# EAGLE board C3D ReMix rev2 (EAGLE 6.4), part 1 of 2
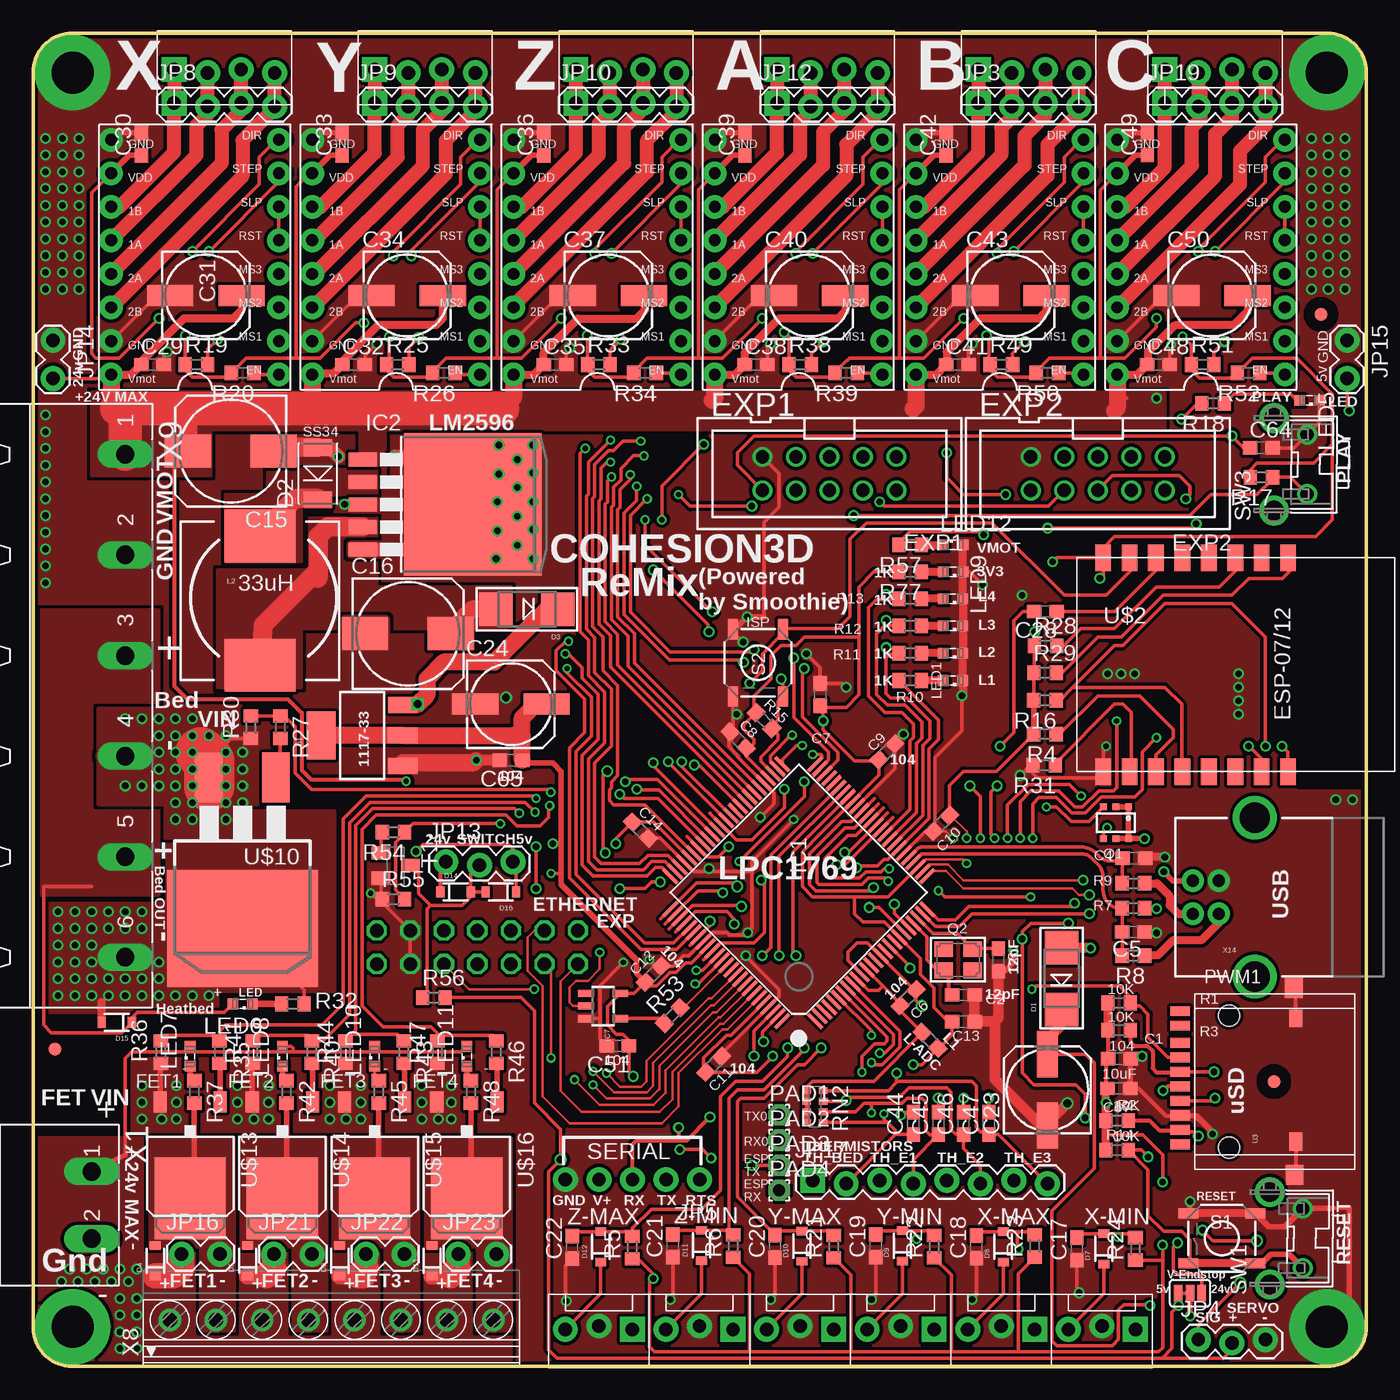
[diagram p3: board, top side]
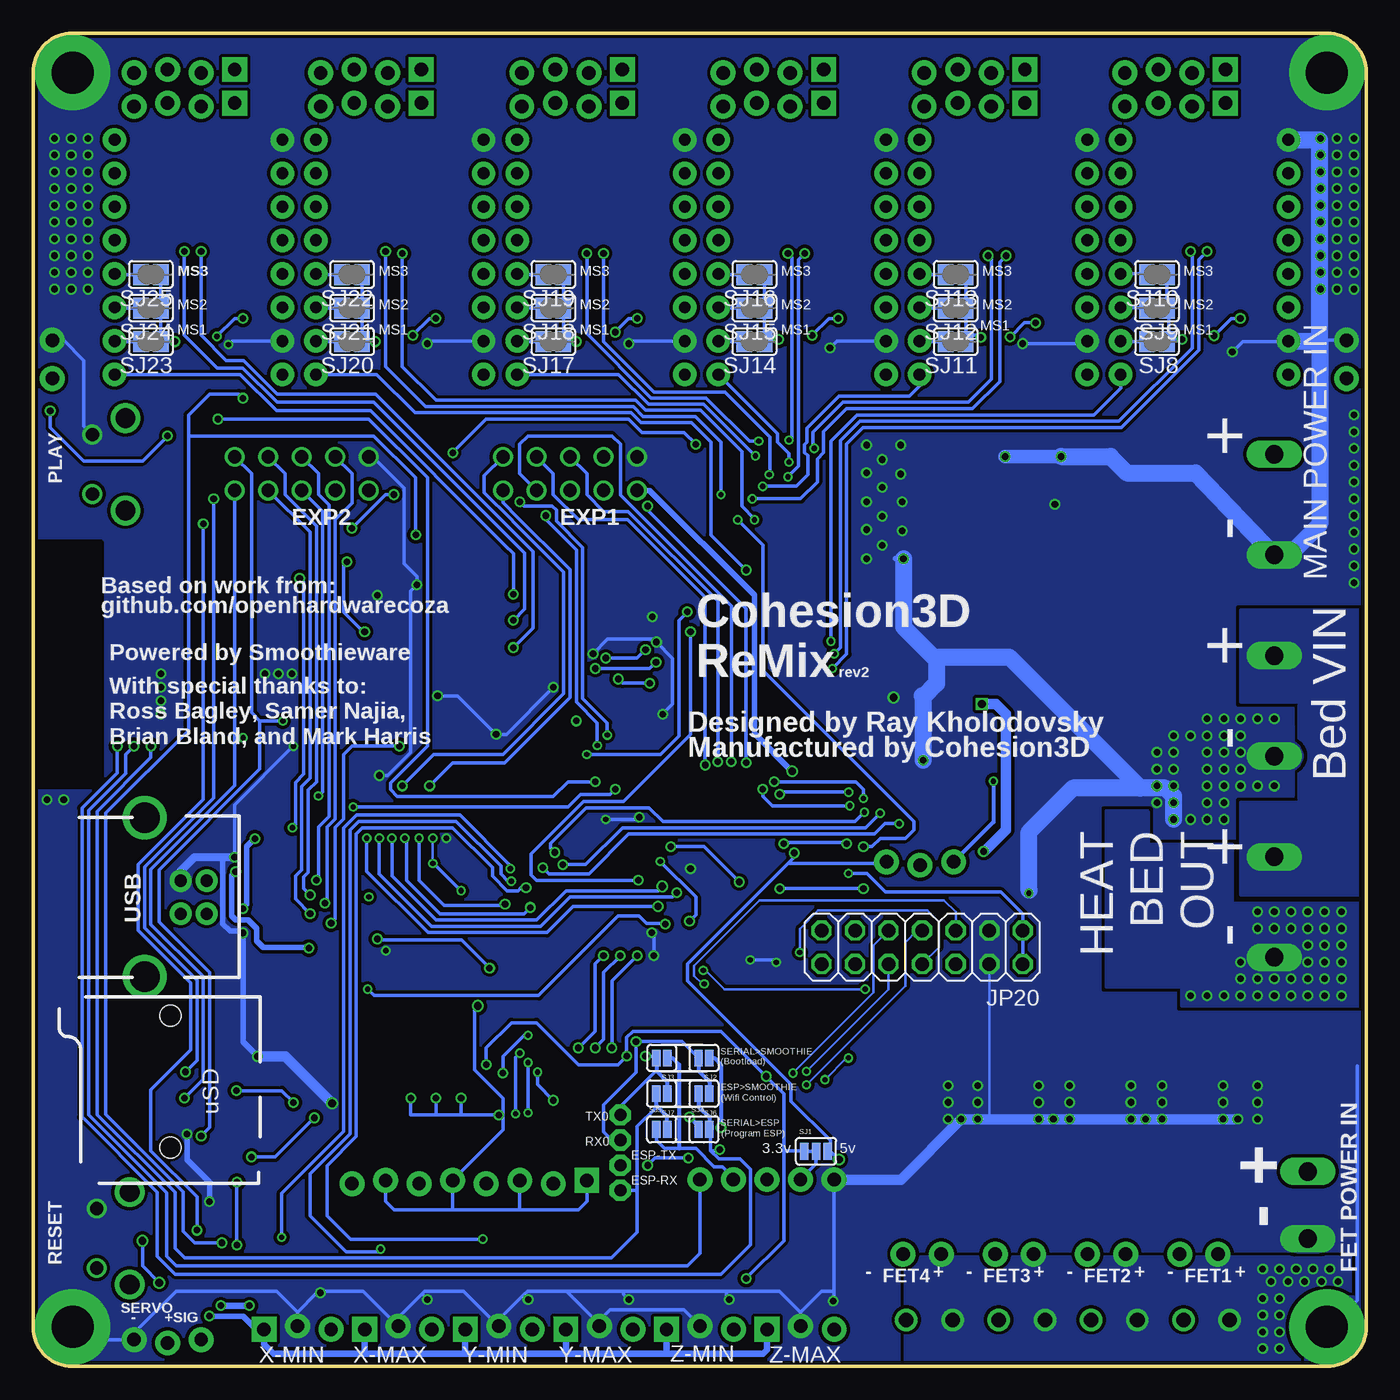
[diagram p4: board, bottom side, seen from below]

Size 101 x 101 mm. Coordinates in mm from the lower left corner, seen from the top.
Outline: 3,0 98,0 arc90 101,3 101,98 arc90 98,101 3,101 arc90 0,98 0,3 arc90 3,0
Copper layers (1*16): Top 0.035mm / dielectric 1.5mm / Bottom 0.035mm
Design rules "dirt_cheap_dirty_boards.v1 *": minimum track width 5mil, minimum drill 12mil, track to track 8mil, track to pad 6mil, pad to pad 6mil, via to via 6mil, smd to smd 0mil, copper to edge 10mil, drill to drill 10mil, minimum pad ring 10mil, minimum via ring 6mil, stop-mask expansion 2mil, vias tented up to drill 25mil, thermal gap 10mil
Net classes: 1 power: width 0.6 mm, clearance 0.305 mm; 2 ground: width 0.254 mm; 4 30-Amp Class: width 2.54 mm; 5 3.3-Amp Class: width 1.27 mm
tRestrict: area 95.9,44 to 101,62.4
bRestrict: area 95.9,44 to 101,62.4

## Footprints (pad centres in the part's own frame; a part is rotated, then mirrored left to right if it is on the bottom)
C0603 = smd 1.1 x 1: 1 -0.85,0; 2 0.85,0
153CLV-0810 = smd 3.5 x 2.5: + 3.25,0; - -3.25,0
153CLV-0605 = smd 3.5 x 1.6: + 2.7,0; - -2.7,0
SMADIODE = smd 2.54 x 2.54: A 2.349,0; C -2.349,0
DO-214AC = smd 1.27 x 2.1: 1 -1.98,0; 2 1.98,0
SOD-323 = smd 0.63 x 0.83: A 1.15,0; C -1.15,0
PAK100/2500-10 = drill 1 pad 1.422: 1 -5.08,-1.27; 2 -5.08,1.27; 3 -2.54,-1.27; 4 -2.54,1.27; 5 0,-1.27; 6 0,1.27; 7 2.54,-1.27; 8 2.54,1.27; 9 5.08,-1.27; 10 5.08,1.27
LQFP100 = smd 0.27 x 1.5: 1 -6,-7.75; 2 -5.5,-7.75; 3 -5,-7.75; 4 -4.5,-7.75; 5 -4,-7.75; 6 -3.5,-7.75; 7 -3,-7.75; 8 -2.5,-7.75; 9 -2,-7.75; 10 -1.5,-7.75; 11 -1,-7.75; 12 -0.5,-7.75; 13 0,-7.75; 14 0.5,-7.75; 15 1,-7.75; 16 1.5,-7.75; 17 2,-7.75; 18 2.5,-7.75; 19 3,-7.75; 20 3.5,-7.75; 21 4,-7.75; 22 4.5,-7.75; 23 5,-7.75; 24 5.5,-7.75; 25 6,-7.75; 51 6,7.75; 52 5.5,7.75; 53 5,7.75; 54 4.5,7.75; 55 4,7.75; 56 3.5,7.75; 57 3,7.75; 58 2.5,7.75; 59 2,7.75; 60 1.5,7.75; 61 1,7.75; 62 0.5,7.75; 63 0,7.75; 64 -0.5,7.75; 65 -1,7.75; 66 -1.5,7.75; 67 -2,7.75; 68 -2.5,7.75; 69 -3,7.75; 70 -3.5,7.75; 71 -4,7.75; 72 -4.5,7.75; 73 -5,7.75; 74 -5.5,7.75; 75 -6,7.75 | smd 1.5 x 0.27: 26 7.75,-6; 27 7.75,-5.5; 28 7.75,-5; 29 7.75,-4.5; 30 7.75,-4; 31 7.75,-3.5; 32 7.75,-3; 33 7.75,-2.5; 34 7.75,-2; 35 7.75,-1.5; 36 7.75,-1; 37 7.75,-0.5; 38 7.75,0; 39 7.75,0.5; 40 7.75,1; 41 7.75,1.5; 42 7.75,2; 43 7.75,2.5; 44 7.75,3; 45 7.75,3.5; 46 7.75,4; 47 7.75,4.5; 48 7.75,5; 49 7.75,5.5; 50 7.75,6; 76 -7.75,6; 77 -7.75,5.5; 78 -7.75,5; 79 -7.75,4.5; 80 -7.75,4; 81 -7.75,3.5; 82 -7.75,3; 83 -7.75,2.5; 84 -7.75,2; 85 -7.75,1.5; 86 -7.75,1; 87 -7.75,0.5; 88 -7.75,0; 89 -7.75,-0.5; 90 -7.75,-1; 91 -7.75,-1.5; 92 -7.75,-2; 93 -7.75,-2.5; 94 -7.75,-3; 95 -7.75,-3.5; 96 -7.75,-4; 97 -7.75,-4.5; 98 -7.75,-5; 99 -7.75,-5.5; 100 -7.75,-6
TO263-5 = smd 1.067 x 2.159: 1 -3.404,-5.791; 2 -1.702,-5.791; 3 0,-5.791; 4 1.702,-5.791; 5 3.404,-5.791 | smd 10.8 x 10.41: 6 0,2.54
SOT23-5 = smd 0.55 x 1.2: 1 -0.95,-1.3; 2 0,-1.3; 3 0.95,-1.3; 4 0.95,1.3; 5 -0.95,1.3
MOLEX-1X4_LOCK = drill 1.016 pad 1.88 square: 1 0,0.127 | drill 1.016 pad 1.88: 2 2.54,-0.127; 3 5.08,0.127; 4 7.62,-0.127
1X04_LOCK = drill 1.016 pad 1.88 square: 1 0,0.127 | drill 1.016 pad 1.88: 2 2.54,-0.127; 3 5.08,0.127; 4 7.62,-0.127
1X03_LOCK = drill 1.016 pad 1.88: 1 0,0.127; 2 2.54,-0.127; 3 5.08,0.127
1X05_NO_SILK = drill 1.016 pad 1.88: 1 0,0; 2 2.54,0; 3 5.08,0; 4 7.62,0; 5 10.16,0
1X02_LOCK = drill 1.016 pad 1.88: 1 -0.178,0; 2 2.718,0
1X08_LOCK = drill 1.016 pad 1.88 square: 1 0,0.127 | drill 1.016 pad 1.88: 2 2.54,-0.127; 3 5.08,0.127; 4 7.62,-0.127; 5 10.16,0.127; 6 12.7,-0.127; 7 15.24,0.127; 8 17.78,-0.127
2X07 = drill 1.016 octagon: 1 -7.62,-1.27; 2 -7.62,1.27; 3 -5.08,-1.27; 4 -5.08,1.27; 5 -2.54,-1.27; 6 -2.54,1.27; 7 0,-1.27; 8 0,1.27; 9 2.54,-1.27; 10 2.54,1.27; 11 5.08,-1.27; 12 5.08,1.27; 13 7.62,-1.27; 14 7.62,1.27
0603 = smd 1.1 x 1: 1 -0.85,0; 2 0.85,0
CDRH125 = smd 5.4 x 4: 1 0,4.9; 2 0,-4.9
SML0603 = smd 0.8 x 0.8: A 0.75,0; C -0.75,0
1,6/0,9 = drill 0.914 pad 1.6 octagon: 1 0,0
SC74_INFINEON = smd 0.5 x 0.5: 1 -0.95,-1.2; 2 0,-1.2; 3 0.95,-1.2; 4 0.95,1.2; 5 0,1.2; 6 -0.95,1.2
CRYSTAL_3.2X2.5 = smd 1.4 x 1.2: 1 -1.1,-0.8; 2 1.1,0.8; GND1 -1.1,0.8; GND2 1.1,-0.8
R0603 = smd 1 x 1.1: 1 -0.85,0; 2 0.85,0
0603-ARV = smd 0.5 x 0.65: 1 -1.2,-0.625; 2 -0.4,-0.625; 3 0.4,-0.625; 4 1.2,-0.625; 5 1.2,0.625; 6 0.4,0.625; 7 -0.4,0.625; 8 -1.2,0.625
TACTILE_SWITCH_SMD = smd 1.524 x 0.762: 1 -2.54,1.905; 2 2.54,1.905; 3 -2.54,-1.905; 4 2.54,-1.905
SJ_3 = smd 0.635 x 1.27: 1 -0.889,0; 2 0,0; 3 0.889,0
SJ_2S = smd 0.635 x 1.27: 1 -0.412,0; 2 0.412,0
SJ = smd 1.168 x 1.6: 1 -0.762,0; 2 0.762,0
SW_TACT_STANDARD_RIGHT_ANGLE = drill 1: 1 -2.25,0; 2 2.25,0 | drill 1.5: 3 -3.5,2.5; 4 3.5,2.5
SOT23-BEC = smd 1 x 1.4: B -0.95,-1.1; C 0,1.1; E 0.95,-1.1
SOT223 = smd 1.219 x 2.235: 1 -2.311,-3.099; 2 0,-3.099; 3 2.311,-3.099 | smd 3.6 x 2.2: 4 0,3.099
USD-SOCKET-PP = smd 0.75 x 1.5: 1 2.925,1.125; 2 1.825,1.125; 3 0.725,1.125; 4 -0.375,1.125; 5 -1.475,1.125; 6 -2.575,1.125; 7 -3.675,1.125; 8 -4.775,1.125; CD1 5.325,1.125; CD2 4.225,1.125 | smd 1.4 x 1: CDNC1 -4.55,-7.65 | smd 1.3 x 1: CDNC2 4.775,-7.65 | smd 1.5 x 1.35: GND1 -7.075,-7.55; GND2 7.075,-7.5 | hole 1.6: -5,-2.6; 5,-2.6
A4988BREAKOUT = drill 0.9 pad 1.778: 1A 8.89,1.27; 1B 11.43,1.27; 2A 6.35,1.27; 2B 3.81,1.27; DIR 16.51,-11.43; EN -1.27,-11.43; GND 16.51,1.27; GND@0 1.27,1.27; MS1 1.27,-11.43; MS2 3.81,-11.43; MS3 6.35,-11.43; RST 8.89,-11.43; SLP 11.43,-11.43; STEP 13.97,-11.43; VDD 13.97,1.27; VMOT -1.27,1.27
ESP8266-ESP12 = smd 2 x 1.2: 1 16.2,2; 2 16.2,4; 3 16.2,6; 4 16.2,8; 5 16.2,10; 6 16.2,12; 7 16.2,14; 8 16.2,16; 9 0,16; 10 0,14; 11 0,12; 12 0,10; 13 0,8; 14 0,6; 15 0,4; 16 0,2
D2PACK = smd 2.083 x 3.81: 1 -2.54,-8.89; 3 2.54,-8.89 | smd 11.43 x 8.89: 2 0,2.54
FIDUCIAL_1MM = smd 1 x 1: 1 0,0
D-PAK_TO252AA = smd 1 x 1.6: 1 -2.28,-4.8; 3 2.28,-4.8 | smd 5.4 x 6.2: 4 0,2.5
MSTBA2 = drill 1.397 long: 1 -2.54,5.08; 2 2.54,5.08
1751303 = drill 1.1 pad 1.7: 1 -12.25,-0.1; 2 -8.75,-0.1; 3 -5.25,-0.1; 4 -1.75,-0.1; 5 1.75,-0.1; 6 5.25,-0.1; 7 8.75,-0.1; 8 12.25,-0.1
GMSTBA6 = drill 1.397 long: 1 -19.05,5.08; 2 -11.43,5.08; 3 -3.81,5.08; 4 3.81,5.08; 5 11.43,5.08; 6 19.05,5.08
USB-B-PTH = drill 0.914 pad 1.676: D+ 0,1.25; D- 1.981,1.25; GND 0,-1.25; VBUS 1.981,-1.25 | drill 2.286: S1 -2.718,-6.02; S2 -2.718,6.02
MOLEX-1X3_LOCK = drill 1.016 pad 1.88 square: 1 0,0.127 | drill 1.016 pad 1.88: 2 2.54,-0.127; 3 5.08,0.127

## Placement (x,y rotation side)
C1  104  [C0603]  82.29,23.32 180 top
C2  12pF  [C0603]  70.47,28.14 0 top
C3  12pF  [C0603]  73.11,30.81 270 top
C4  18pF  [C0603]  83.39,38.5 180 top
C5  18pF  [C0603]  83.34,32.91 180 top
C6  104  [C0603]  66.28,27.93 45 top
C7  10uF  [C0603]  59.62,50.88 90 top
C8  104  [C0603]  53.41,47.46 315 top
C9  104  [C0603]  64.67,46.56 225 top
C10  104  [C0603]  68.81,41.14 45 top
C11  104  [C0603]  51.55,22.88 225 top
C12  104  [C0603]  46.98,29.72 225 top
C13  104  [C0603]  70.46,26.12 180 top
C14  104  [C0603]  46.01,40.63 135 top
C15  220uF  [153CLV-0810]  14.99,69.34 180 top
C16  220uF  [153CLV-0810]  28.4,55.5 0 top
C17  104  [C0603]  79.07,8.93 90 top
C18  104  [C0603]  71.45,9.06 90 top
C19  104  [C0603]  63.83,9.14 90 top
C20  104  [C0603]  56.21,9.12 90 top
C21  104  [C0603]  48.46,9.14 90 top
C22  104  [C0603]  40.84,9.01 90 top
C23  100uF  [153CLV-0605]  76.83,20.95 90 top
C24  100uF  [153CLV-0605]  36.2,50.16 0 top
C28  104  [C0603]  76.69,57.19 180 top
C29  104  [C0603]  9.05,75.88 0 top
C30  104  [C0603]  8.21,92.58 90 top
C31  100uF  [153CLV-0605]  13.1,81.12 0 top
C32  104  [C0603]  24.29,75.88 0 top
C33  104  [C0603]  23.42,92.58 90 top
C34  100uF  [153CLV-0605]  28.34,81.12 0 top
C35  104  [C0603]  39.53,75.88 0 top
C36  104  [C0603]  38.69,92.58 90 top
C37  100uF  [153CLV-0605]  43.58,81.12 0 top
C38  104  [C0603]  54.77,75.88 0 top
C39  104  [C0603]  53.93,92.58 90 top
C40  100uF  [153CLV-0605]  58.82,81.12 0 top
C41  104  [C0603]  70.01,75.88 0 top
C42  104  [C0603]  69.17,92.58 90 top
C43  100uF  [153CLV-0605]  74.06,81.12 0 top
C44  10uF  [C0603]  66.67,18.41 90 top
C45  10uF  [C0603]  68.58,18.41 90 top
C46  10uF  [C0603]  70.48,18.41 90 top
C47  10uF  [C0603]  72.39,18.41 90 top
C48  104  [C0603]  85.25,75.88 0 top
C49  104  [C0603]  84.41,92.6 90 top
C50  100uF  [153CLV-0605]  89.3,81.12 0 top
C51  104  [C0603]  44.29,24.29 180 top
C64  10uF  [C0603]  93.03,69.57 0 top
C65  104  [C0603]  36.21,45.92 180 top
C67  10uF  [C0603]  82.25,21.07 180 top
D1  MBRA210LT3  [SMADIODE]  77.9,29.39 90 top
D2  SS34  [DO-214AC]  21.59,67.63 90 top
D3  MBRA210LT3  [SMADIODE]  37.41,57.36 180 top
D4  1N4148  [SOD-323]  9.27,8 90 top
D5  1N4148  [SOD-323]  16.26,8 90 top
D6  1N4148  [SOD-323]  23.24,8 90 top
D7  1N4148  [SOD-323]  81.1,8.91 90 top
D8  1N4148  [SOD-323]  73.48,9.06 90 top
D9  1N4148  [SOD-323]  65.86,9.14 90 top
D10  1N4148  [SOD-323]  58.24,9.12 90 top
D11  1N4148  [SOD-323]  50.62,9.17 90 top
D12  1N4148  [SOD-323]  43,9.06 90 top
D13  1N4148  [SOD-323]  30.23,8 90 top
D14  1N4148  [SOD-323]  32,35.94 0 top
D15  1N4148  [SOD-323]  6.35,26.07 180 top
D16  1N4148  [SOD-323]  35.43,35.94 180 top
EXP1  2510-  [PAK100/2500-10]  60.33,67.63 180 top
EXP2  2510-  [PAK100/2500-10]  80.64,67.63 180 top
IC1  LPC1769  [LQFP100]  58,35.89 45 top
IC2  LM2596-5  [TO263-5]  30.77,65.29 270 top
IC7  74LVC1G04  [SOT23-5]  43.18,27.3 270 top
JP1  [MOLEX-1X4_LOCK]  71.6,98.11 0 top
JP2  [MOLEX-1X4_LOCK]  25.88,98.11 0 top
JP3  [1X04_LOCK]  71.6,95.57 0 top
JP4  [1X03_LOCK]  88.27,1.91 0 top
JP5  [1X05_NO_SILK]  50.49,14.15 180 top
JP6  [MOLEX-1X4_LOCK]  10.68,98.11 0 top
JP7  [MOLEX-1X4_LOCK]  41.12,98.11 0 top
JP8  [1X04_LOCK]  10.68,95.57 0 top
JP9  [1X04_LOCK]  25.88,95.57 0 top
JP10  [1X04_LOCK]  41.12,95.57 0 top
JP11  [MOLEX-1X4_LOCK]  56.36,98.11 0 top
JP12  [1X04_LOCK]  56.36,95.57 0 top
JP13  [1X03_LOCK]  31.27,38.1 0 top
JP14  [1X02_LOCK]  1.51,77.55 270 top
JP15  [1X02_LOCK]  99.54,77.55 270 top
JP16  [1X02_LOCK]  11.43,8.51 0 top
JP17  [1X08_LOCK]  59.05,13.97 0 top
JP18  [MOLEX-1X4_LOCK]  85.72,98.11 0 top
JP19  [1X04_LOCK]  85.72,95.57 0 top
JP20  [2X07]  33.66,31.75 180 bottom
JP21  [1X02_LOCK]  18.41,8.51 0 top
JP22  [1X02_LOCK]  25.4,8.51 0 top
JP23  [1X02_LOCK]  32.38,8.51 0 top
L1  39nH  [0603]  67.94,24.7 315 top
L2  33uH  [CDRH125]  17.2,58.01 0 top
LED1  GREEN  [SML0603]  69.68,51.96 180 top
LED2  GREEN  [SML0603]  69.68,54.04 180 top
LED3  GREEN  [SML0603]  69.68,56.1 180 top
LED4  GREEN  [SML0603]  69.68,58.15 180 top
LED5  GREEN  [SML0603]  96.68,73.18 180 top
LED6  RED  [SML0603]  15.88,27.46 180 top
LED7  RED  [SML0603]  11.91,23.5 90 top
LED8  RED  [SML0603]  18.89,23.5 90 top
LED9  GREEN  [SML0603]  69.69,60.19 180 top
LED10  RED  [SML0603]  25.88,23.5 90 top
LED11  RED  [SML0603]  32.86,23.5 90 top
LED12  RED  [SML0603]  69.69,62.23 0 top
PAD1  [1,6/0,9]  56.52,19.05 0 top
PAD2  [1,6/0,9]  56.52,17.14 0 top
PAD3  [1,6/0,9]  56.52,15.24 0 top
PAD4  [1,6/0,9]  56.52,13.34 0 top
Q1  BSL207SP  [SC74_INFINEON]  82.02,41.18 180 top
Q2  12MHz  [CRYSTAL_3.2X2.5]  70.06,30.81 180 top
R1  10K  [R0603]  82.27,27.54 180 top
R2  10K  [R0603]  82.11,18.64 180 top
R3  10K  [R0603]  82.27,25.46 180 top
R4  10K  [R0603]  76.64,47.9 180 top
R5  10K  [R0603]  45.39,9.02 90 top
R6  10K  [R0603]  53.03,9.13 90 top
R7  1.5k  [R0603]  83.34,34.7 0 top
R8  33R  [R0603]  83.34,31.13 180 top
R9  33R  [R0603]  83.34,36.59 180 top
R10  1k  [R0603]  66.44,51.96 180 top
R11  1k  [R0603]  66.44,54.04 180 top
R12  1k  [R0603]  66.44,56.1 180 top
R13  1k  [R0603]  66.44,58.15 180 top
R14  10K  [R0603]  82.11,16.39 180 top
R15  10K  [R0603]  55.37,48.92 135 top
R16  10K  [R0603]  76.64,50.45 180 top
R17  10K  [R0603]  93.04,67.36 180 top
R18  1k  [R0603]  89.38,72.95 180 top
R19  1k  [R0603]  12.38,75.88 0 top
R20  10K  [R0603]  15.88,75.25 180 top
R21  10K  [R0603]  60.65,9.08 90 top
R22  10K  [R0603]  68.25,9.08 90 top
R23  10K  [R0603]  75.87,9.13 90 top
R24  10K  [R0603]  83.49,8.91 90 top
R25  1k  [R0603]  27.62,75.88 0 top
R26  10k  [R0603]  31.11,75.25 180 top
R27  10r  [R0603]  18.73,48.42 270 top
R28  10K  [R0603]  76.69,54.6 0 top
R29  10K  [R0603]  76.65,52.53 0 top
R30  100k  [R0603]  16.51,48.42 90 top
R31  10K  [R0603]  76.59,45.55 180 top
R32  1.5k  [R0603]  19.68,27.46 0 top
R33  1k  [R0603]  42.86,75.88 0 top
R34  10K  [R0603]  46.35,75.25 180 top
R35  10r  [R0603]  14.13,23.81 270 top
R36  100k  [R0603]  9.68,23.81 90 top
R37  1.5k  [R0603]  12.22,20.8 270 top
R38  1k  [R0603]  58.1,75.88 0 top
R39  10K  [R0603]  61.59,75.25 180 top
R40  10r  [R0603]  21.11,23.81 270 top
R41  100k  [R0603]  16.67,23.81 90 top
R42  1.5k  [R0603]  19.21,20.8 270 top
R43  10r  [R0603]  28.1,23.81 270 top
R44  100k  [R0603]  23.65,23.81 90 top
R45  1.5k  [R0603]  26.19,20.8 270 top
R46  10r  [R0603]  35.08,23.81 270 top
R47  100k  [R0603]  30.64,23.81 90 top
R48  1.5k  [R0603]  33.18,20.8 270 top
R49  1k  [R0603]  73.34,75.88 0 top
R50  10K  [R0603]  76.83,75.25 180 top
R51  1k  [R0603]  88.58,75.88 0 top
R52  10K  [R0603]  92.08,75.25 180 top
R53  22R  [R0603]  48.42,26.59 45 top
R54  10r  [R0603]  27.3,40.48 180 top
R55  100k  [R0603]  27.3,35.4 0 top
R56  10k  [R0603]  30.35,27.94 0 top
R57  1.5k  [R0603]  66.44,62.23 180 top
R77  1k  [R0603]  66.44,60.19 180 top
RN2  4k7  [0603-ARV]  59.21,19.68 90 top
S1  [TACTILE_SWITCH_SMD]  90.04,9.71 180 top
S2  [TACTILE_SWITCH_SMD]  54.91,53.3 270 top
SJ1  [SJ_3]  41.69,16.31 0 bottom
SJ2  [SJ_2S]  50.18,23.36 180 bottom
SJ3  [SJ_2S]  53.38,23.36 180 bottom
SJ4  [SJ_2S]  50.18,17.96 0 bottom
SJ5  [SJ_2S]  53.38,17.96 0 bottom
SJ6  [SJ_2S]  50.18,20.66 180 bottom
SJ7  [SJ_2S]  53.38,20.66 180 bottom
SJ8  [SJ]  15.88,77.63 180 bottom
SJ9  [SJ]  15.88,80.17 180 bottom
SJ10  [SJ]  15.88,82.71 180 bottom
SJ11  [SJ]  31.11,77.63 180 bottom
SJ12  [SJ]  31.11,80.17 180 bottom
SJ13  [SJ]  31.11,82.71 180 bottom
SJ14  [SJ]  46.35,77.63 180 bottom
SJ15  [SJ]  46.35,80.17 180 bottom
SJ16  [SJ]  46.35,82.71 180 bottom
SJ17  [SJ]  61.59,77.63 180 bottom
SJ18  [SJ]  61.59,80.17 180 bottom
SJ19  [SJ]  61.59,82.71 180 bottom
SJ20  [SJ]  76.83,77.63 180 bottom
SJ21  [SJ]  76.83,80.17 180 bottom
SJ22  [SJ]  76.83,82.71 180 bottom
SJ23  [SJ]  92.08,77.63 180 bottom
SJ24  [SJ]  92.08,80.17 180 bottom
SJ25  [SJ]  92.08,82.71 180 bottom
SJ26  [SJ_3]  87.63,5.56 0 top
SW1  SW_TACT_4P_B  [SW_TACT_STANDARD_RIGHT_ANGLE]  96.18,9.71 90 top
SW3  SW_TACT_4P_B  [SW_TACT_STANDARD_RIGHT_ANGLE]  96.5,68.33 90 top
T1  BC817  [SOT23-BEC]  27.46,37.94 270 top
U1  1117-3.3  [SOT223]  24.92,47.79 90 top
U3  USD-SOCKETUSD  [USD-SOCKET-PP]  88,21.59 90 top
U$1  POLOLU_A4983CARRIER  [A4988BREAKOUT]  7.19,76.41 90 top
U$2  ESP8266_ESP-12  [ESP8266-ESP12]  79.06,61.26 270 top
U$5  POLOLU_A4983CARRIER  [A4988BREAKOUT]  22.42,76.41 90 top
U$6  POLOLU_A4983CARRIER  [A4988BREAKOUT]  37.66,76.41 90 top
U$7  POLOLU_A4983CARRIER  [A4988BREAKOUT]  52.9,76.41 90 top
U$8  POLOLU_A4983CARRIER  [A4988BREAKOUT]  68.14,76.41 90 top
U$9  POLOLU_A4983CARRIER  [A4988BREAKOUT]  83.38,76.41 90 top
U$10  SUM120N04-1M7L-GE3  [D2PACK]  15.88,35.72 180 top
U$11  FIDUCIAL  [FIDUCIAL_1MM]  93.98,21.59 0 top
U$12  FIDUCIAL  [FIDUCIAL_1MM]  97.55,79.69 0 top
U$13  SUD50N04  [D-PAK_TO252AA]  11.91,15.24 180 top
U$14  SUD50N04  [D-PAK_TO252AA]  18.89,15.24 180 top
U$15  SUD50N04  [D-PAK_TO252AA]  25.88,15.24 180 top
U$16  SUD50N04  [D-PAK_TO252AA]  32.86,15.24 180 top
U$17  FIDUCIAL  [FIDUCIAL_1MM]  1.65,24.03 0 top
X1  MSTBA2  [MSTBA2]  -0.64,12.22 270 top
X8  1751303  [1751303]  22.61,3.63 0 top
X9  GMSTBA6  [GMSTBA6]  1.91,50.04 270 top
X14  USBPTH  [USB-B-PTH]  89.82,35.54 180 top
XMN  [MOLEX-1X3_LOCK]  83.5,2.94 180 top
XMX  [MOLEX-1X3_LOCK]  75.88,2.94 180 top
YMN  [MOLEX-1X3_LOCK]  68.26,2.94 180 top
YMX  [MOLEX-1X3_LOCK]  60.64,2.94 180 top
ZMN  [MOLEX-1X3_LOCK]  53.02,2.94 180 top
ZMX  [MOLEX-1X3_LOCK]  45.4,2.94 180 top

## Tracks (layer width: path | path; a pad name or v marks a point on that pad's centre or on a via)
1A1M
  Top 1.016: JP8.2 13.22,94.82
  Top 1.067: 13.22,94.82 12.38,93.98 12.38,91.76 U$1.1A | JP8.2 JP6.2
1A2M
  Top 1.067: JP2.2 JP9.2 28.42,94.81 27.62,94.01 27.62,91.6 21.32,85.3 U$5.1A
1A3M
  Top 1.016: 43.66,94.93 JP10.2
  Top 1.067: JP7.2 JP10.2 | 43.66,94.93 42.86,94.14 42.86,91.77 U$6.1A
1A$4M
  Top 1.016: 58.1,94.3 59.05,95.25 59.05,95.28 JP12.2
  Top 1.067: 58.1,94.3 58.1,91.77 U$7.1A | JP11.2 JP12.2
1A$5M
  Top 1.067: U$8.1A 73.34,91.77 73.34,93.82 74.14,94.61 JP3.2 JP1.2
1A$6M
  Top 0.254: JP19.2 88.42,95.44 88.42,94.61
  Top 1.067: JP18.2 JP19.2 | 88.42,96.55 88.42,94.61 88.42,94.46 87.79,93.82 87.79,90.96 87.78,90.96 U$9.1A
1B1M
  Top 1.067: JP6.1 JP8.1 10.68,91.96 6.56,87.84 U$1.1B
1B2M
  Top 1.067: JP2.1 JP9.1 25.88,91.92 21.8,87.84 U$5.1B
1B3M
  Top 1.067: JP7.1 JP10.1 41.12,91.92 37.04,87.84 U$6.1B
1B$4M
  Top 1.067: JP11.1 JP12.1 56.36,91.92 52.28,87.84 U$7.1B
1B$5M
  Top 1.067: JP1.1 JP3.1 71.6,91.92 67.52,87.84 U$8.1B
1B$6M
  Top 1.067: JP18.1 JP19.1 85.72,90.81 83.5,88.58 83.19,88.27 82.76,87.84 U$9.1B
2
  Top 0.254: R4.1 77.75,47.9 80.64,50.8 83.82,50.8 86.36,48.26 86.36,47.62 85.06,46.32 U$2.3
2A1M
  Top 1.016: JP8.3 15.76,95.14
  Top 1.067: U$1.2A 14.29,91.12 14.29,93.66 15.76,95.14 | JP8.3 JP6.3
2A2M
  Top 1.067: U$5.2A 21.32,82.76 29.53,90.96 29.53,93.66 30.96,95.09 JP9.3 JP2.3
2A3M
  Top 1.016: 46.04,95.09 46.04,95.54 JP10.3
  Top 1.067: 36.4,82.76 44.77,91.12 44.77,93.82 46.04,95.09 | JP7.3 JP10.3
  Top 1.27: U$6.2A 36.4,82.76
2A$4M
  Top 1.016: 59.85,93.5 61.59,95.25 61.59,95.54 JP12.3
  Top 1.067: 59.85,93.5 59.85,90.97 U$7.2A | JP11.3 JP12.3
2A$5M
  Top 1.067: U$8.2A 75.09,90.97 75.09,93.19 76.68,94.77 JP3.3 JP1.3
2A$6M
  Top 1.067: U$9.2A 89.53,90.17 89.53,93.34 90.49,94.3 90.81,94.61 JP19.3 JP18.3
  Top 1.27: U$9.2A
2B1M
  Top 1.067: 18.26,95.25 15.88,92.87 15.88,90.17 U$1.2B | JP8.4 JP6.4
  Top 1.27: JP8.4 18.3,95.36 18.41,95.25 18.26,95.25
2B2M
  Top 1.067: JP2.4 JP9.4 | 33.5,95.09 31.27,92.87 31.27,90.33 21.16,80.22 U$5.2B
  Top 1.27: JP9.4 33.5,95.09
2B3M
  Top 1.016: JP10.4 48.74,95.09
  Top 1.067: 36.39,80.37 46.51,90.49 46.51,92.87 48.74,95.09 | JP7.4 JP10.4
  Top 1.27: U$6.2B 36.39,80.37
2B$4M
  Top 1.016: 63.9,94.85 63.9,95.36
  Top 1.067: 63.9,94.85 61.59,92.55 61.59,90.18 U$7.2B | JP11.4 JP12.4 63.9,95.36
2B$5M
  Top 1.067: U$8.2B 76.83,90.18 76.83,92.55 79.22,94.93 JP3.4 JP1.4
2B$6M
  Top 1.067: U$9.2B 91.44,89.53 91.44,92.08 92.71,93.34 93.34,93.98 JP19.4 JP18.4
  Top 1.27: U$9.2B
3.3V  (via drill 0.4, 0.5)
  Top 0.203: IC1.28 67.59,38.41 70.42,38.41 v70.72,38.1 | v70.72,40.01 70.72,40.51 69.49,41.74 C10.2
  Top 0.254: IC1.71 47,41.23 C14.2 | IC1.84 49.87,30.58 49.42,30.58 48.69,29.85 48.26,29.85 47.23,28.81 46.67,28.81 | 81.26,20.81 C67.2 81.13,20.89 | IC1.96 52.86,25.09 52.52,25.09 50.8,23.37 50.8,22.43 C11.2 54.83,22.28 v56.04,23.5 | C14.2 45.41,40.97 | v44.13,39.61 44.13,39.95 C14.2 | 65.27,60.19 R77.2 63.69,60.19 62.55,59.05 62.55,55.24 | 81.26,17.62 81.34,17.54 84.06,17.54 85.57,16.03 v85.57,13.97 | v46.99,6.67 46.7,6.38 46.7,1.48 47.07,1.11 54.28,1.11 | 54.28,1.11 61.95,1.11 | 61.95,1.11 69.55,1.11 | 46.48,29.17 46.48,29.23 C12.2 45.51,28.25 IC7.5 43.5,27.27 43.5,25.88 44.21,25.16 44.69,25.16 45.14,24.71 C51.1 45.14,22.3 v45.47,21.97 | 45.72,29.78 45.72,29.77 46.67,28.81 | 46.67,28.81 46.59,28.81 46.35,28.57 | R16.2 75.8,50.47 R29.1 75.84,52.57 R28.1 75.84,55.6 v75.88,55.64 | 62.23,35.56 64.74,35.56 IC1.28 | 62.23,35.56 59.05,35.56 58.26,36.35 58.26,38.97 59.69,40.4 59.69,40.41 IC1.42 64.07,44.78 64.07,45.89 C9.2 64.01,45.88 62.23,45.88 59.85,48.26 v59.85,48.9 59.85,49.96 C7.1 59.73,49.93 61.59,49.93 62.55,50.88 62.55,55.24 | 37.26,45.72 C65.1 | 75.58,47.9 R4.2 72.97,45.09 70.48,45.09 69.41,44.01 C10.2 | 35.16,76.36 31.27,76.36 30.27,75.35 R26.2 29.95,74.93 27.3,74.93 26.67,75.56 26.67,75.88 R25.1 26.99,76.1 v26.99,77.98 | 35.16,76.36 36.99,76.36 v40.01,79.38 | v25.05,79.06 24.45,79.06 21.75,76.36 19.93,76.36 | 19.93,76.36 16.14,76.36 R20.2 14.71,74.93 12.06,74.93 11.53,75.46 R19.1 v11.53,78.08 | 19.93,76.36 19.93,89.37 20.94,90.38 U$5.VDD | R17.2 92.19,67.9 92.71,68.42 97,68.42 98.42,69.85 | v9.56,79.38 9.53,79.38 6.54,76.39 4.76,76.39 4.45,76.71 4.45,88.9 U$1.VDD
  Top 0.254: U$2.16 81.06,62.01 81.92,62.87 97.16,62.87 98.42,64.14 98.42,69.85 | U$2.16 77.54,61.26 v77.23,60.96 | U$2.16 81.06,59.91 80.83,59.69 v80.8,59.69 | Q1.4 81.07,40.51 v81.36,40.8 | v66.67,22.86 67.31,22.86 L1.2 68.59,24.15 68.7,24.19 69.61,25.1 C13.2 69.29,26.12 68.22,27.18 68.22,28.68 67.22,29.68 67.22,30.91 IC1.19 64.48,33.66 62.87,33.66 62.23,34.29 62.23,35.56 | 62.55,55.24 58.42,55.24 57.78,54.61 56.64,54.61 55.88,53.85 55.88,52.07 54.61,50.8 54.61,49.68 R15.2 53.82,48.58 53.82,48.28 54.62,47.48 54.62,47.18 54.3,46.86 C8.2 54.01,46.24 IC1.54 | v39.37,39.61 39.69,39.69 40.01,39.37 | v68.58,36.04 69.06,35.56 v75.56,35.56 | 46.98,6.66 v46.99,6.67 | v41.99,78.11 42.01,78.08 R33.1 42.01,75.46 42.55,74.93 45.19,74.93 R34.2 45.51,75.35 46.51,76.36 50.41,76.36 | 35.16,76.36 35.16,89.14 U$6.VDD | 50.41,76.36 52.23,76.36 v55.24,79.38 | v56.91,78.34 57.25,78 R38.1 57.15,75.78 57.15,75.56 57.78,74.93 60.96,74.93 60.74,75.14 R39.2 60.74,75.35 61.59,76.2 61.67,76.2 61.83,76.36 65.61,76.36 | 50.41,76.36 50.41,89.15 U$7.VDD | 65.61,76.36 67.47,76.36 v70.48,79.38 | 72.39,75.78 72.39,75.56 73.03,74.93 75.56,74.93 75.88,75.25 R50.2 75.98,75.35 76.99,76.36 80.84,76.36 | 72.39,75.78 R49.1 | 65.61,76.36 65.61,89.12 U$8.VDD | 72.39,75.78 72.39,77.95 v72.23,78.11 | 80.84,76.36 82.71,76.36 85.09,78.74 v85.09,79.38 | v87.07,78.03 87.73,77.37 R51.1 87.63,75.78 87.63,75.56 88.34,74.85 91.2,74.85 91.22,74.87 R52.2 92.34,76.36 95.73,76.36 98.42,73.66 98.42,69.85 | 80.84,76.36 80.84,89.1 U$9.VDD | 69.55,1.11 74.63,1.11 | 74.63,1.11 85.25,1.11 85.57,1.43 v85.57,9.21 85.57,8.06 R24.1
  Top 0.254: 81.4,23.29 81.44,23.29 C1.2 | v81.27,20 81.27,19.69 81.26,19.68 | v11.53,78.08 | v11.53,78.08 | v46.99,6.67 46.99,6.99 45.81,8.16 R5.1 | 54.28,1.11 54.28,7.03 R6.1 | 61.95,1.11 61.95,6.93 R21.1 | 69.55,1.11 69.55,6.93 R22.1 | 74.63,1.11 74.63,7.04 R23.1 | v39.24,37.34 40.01,37.34
  Top 0.305: 81.4,25.44 81.4,23.36 C1.2 | 81.26,20.81 81.26,20.93 81.3,21.19 81.3,23.19 81.4,23.29 | U3.4 85.92,21.21 v85.6,20.89
  Top 0.406: 81.26,18.54 R2.2 | 81.4,25.44 R3.2 | 81.4,27.52 R1.2 | R4.2 R16.2 | C12.2 45.72,29.78 45.72,30.8 40.01,36.51 40.01,37.34 40.01,39.37 40.01,45.09 39.37,45.72 37.26,45.72 | C30.1 7.28,91.73 U$1.VDD | C33.1 22.51,91.73 U$5.VDD | C36.1 37.75,91.73 U$6.VDD | C39.1 52.99,91.73 U$7.VDD | C42.1 68.23,91.73 U$8.VDD | C49.1 83.49,91.75 U$9.VDD
  Top 0.61: R2.2 81.26,19.68 81.26,20.81 | R14.2 81.26,17.62 81.26,18.54 | 81.4,25.44 81.4,27.52
  Top 1.016: 36.43,47.79 37.06,47.78
  Top 1.27: C65.1 37.06,47.78 37.06,49.12 38.1,50.16 C24.+ | 36.43,47.79 U1.2 U1.4
  Bottom 0.203: v70.72,38.1 v70.72,40.01
  Bottom 0.254: SJ1.1 42.75,16.31 | 44.13,16.35 44.13,20.64 v45.47,21.97 48.9,25.4 55.56,25.4 56.04,24.92 v56.04,23.5 56.67,22.86 59.69,22.86 62.87,26.04 64.77,26.04 66.67,24.13 v66.67,22.86 | v77.23,60.96 77.47,60.72 77.47,57.15 75.96,55.64 v75.88,55.64 | v81.36,40.8 81.12,41.04 81.12,44.23 80.49,44.86 80.49,59.4 80.77,59.69 v80.8,59.69 | v70.72,38.1 70.64,38.1 v68.58,36.04 | v44.13,39.61 44.05,39.69 39.45,39.69 v39.37,39.61 | JP5.4 41.69,15.33 SJ1.2 SJ1.1 | 44.13,16.35 42.71,16.35 | 42.71,16.35 42.55,16.51 | 42.71,16.35 42.62,16.35 SJ1.1 | v85.6,20.89 82.16,20.89 v81.27,20 | v25.05,79.06 25.91,79.06 v26.99,77.98 | v9.56,79.38 10.24,79.38 v11.53,78.08 | v40.01,79.38 40.72,79.38 v41.99,78.11 | v55.24,79.38 55.88,79.38 v56.91,78.34 | v70.48,79.38 70.96,79.38 v72.23,78.11 | v85.09,79.38 85.72,79.38 v87.07,78.03 | v85.57,13.97 v85.57,9.21 | 44.13,16.35 44.13,9.53 v46.99,6.67 | JP20.2 JP20.1 26.04,34.29 27.69,35.94 36.45,35.94 37.85,37.34 v39.24,37.34
5V  (via drill 0.5, 0.6)
  Top 0.254: C64.1 91.72,69.57 v90.81,70.48 54.61,70.48 53.34,69.22 53.34,68.26 EXP1.10 | v29.01,39.01 29.53,39.53 36.04,39.53 36.35,39.21 JP13.3 36.58,38 D16.C | v43.34,38.89 43.18,39.05 43.18,44.77 v43.5,45.09 | 85.53,0.64 39.69,0.64 39.05,1.27 39.05,14.75 v39.97,15.67 39.97,17.96 37.97,19.95 37.97,26.92 36.96,27.94 R56.2 | 85.53,0.64 86.27,1.36 86.27,4.11 v86.76,4.6 | SJ26.1 87.55,5.56 | v84.61,4.6 84.53,4.68 82.61,4.68 82.21,4.29 82.21,2.06 81.74,1.59 77.53,1.59 77.17,1.96 77.17,11.79 80.39,15.02 80.39,22.99 79.72,23.66 C23.+ | 85.53,0.64 90.17,0.64 90.81,1.27 JP4.2 | JP15.2 99.54,72.55 v99.69,72.39 | v29.14,50.16 28.7,50.29 U1.3
  Top 0.508: SJ26.1 86.74,4.86 v86.76,4.6
  Top 0.813: 77.78,26.91 77.78,25.7 76.83,24.77 C23.+
  Top 1.27: 77.78,26.91 D1.C | v29.14,50.16 29.84,50.86 29.84,52.07 31.11,53.34 34.92,53.34 38.95,57.36 D3.C
  Bottom 0.254: SJ1.3 40.61,16.31 | 40.61,16.31 v39.97,15.67 | 40.61,16.31 40.61,17.11 43.58,20.08 43.58,21.35 51.44,29.21 51.44,30.48 43.81,38.1 | 43.81,38.1 36.48,38.1 JP13.3 | v43.34,38.89 43.34,38.58 43.81,38.1 | v99.69,72.39 99.69,71.12 97.16,68.58 92.71,68.58 v90.81,70.48
  Bottom 0.406: EXP1.10 54.29,66.36 46.35,58.42 46.35,47.94 v43.5,45.09
  Bottom 0.508: v84.61,4.6 v86.76,4.6
  Bottom 0.813: v29.14,50.16 28.07,50.16 27.3,49.4 27.3,40.64 28.93,39.01 v29.01,39.01
5VREG
  Top 1.27: D3.A 33.23,57.36 31.7,55.83 C16.+
  Top 1.422: 21.59,60.33 21.59,59.69 | 21.59,60.33 17.45,56.19 L2.2 | IC2.4 22.31,63.59 21.59,62.87 21.59,60.33
  pour Top (isolate 0.406, rank 2, no thermals): 26.04,64.26 20.32,64.26 20.32,60.33 13.97,60.33 13.97,51.44 20.32,51.44 20.32,55.88 36.2,55.88 36.2,59.05 26.04,59.05
12
  Top 0.254: C28.1 81.96,57.19 85.09,60.33 85.09,61.23 U$2.14
15
  Top 0.254: R31.1 77.44,45.69 81.92,50.16 82.55,50.16 83.19,49.53 83.19,45.19 U$2.2
24V  (via drill 0.4, 0.5)
  Top 0.254: 21.57,75.56 U$5.VMOT 21.15,75.25 | C32.1 23.44,75.98 | 8.26,76.2 8.26,75.94 C29.1 | SJ26.3 88.52,6.73 88.27,6.99 86.68,6.99 86.36,7.3 86.36,9.05 v86.68,9.37 | 82.87,73.34 81.92,72.39 | 46.35,81.04 C37.+ | 69.22,75.94 C41.1 | 84.45,75.94 C48.1 | JP14.2 5.62,74.83 U$1.VMOT | R57.2 65.58,62.41 66.42,63.25 71.75,63.25 v72.01,62.99
  Top 0.305: 10.7,71.82 10.7,51.53 11.68,50.55 19.3,50.55 20.35,49.5 20.35,45.18 21.08,44.45 28.12,44.45 v28.26,44.34 | D14.C 30.85,37.81 JP13.1
  Top 0.61: C34.+ 31.04,79.38 30.56,78.9 26.19,78.9 23.44,76.14 23.44,75.98 | 21.15,75.25 22.8,75.25 C32.1 | U$1.VMOT 7.45,75.14 C29.1 | C31.+ 15.8,80.01 15.16,79.38 11.43,79.38 8.26,76.2 | 46.35,81.04 46.35,80.01 45.72,79.38 41.27,79.38 38.68,76.78 C35.1 37.93,75.14 U$6.VMOT | U$7.VMOT 53.17,75.14 C38.1 53.92,76.78 56.52,79.38 60.96,79.38 61.52,79.93 C40.+ | U$8.VMOT 68.41,75.14 C41.1 | C43.+ 76.76,79.93 76.2,79.38 71.75,79.38 69.22,76.83 69.22,75.94 | U$9.VMOT 83.65,75.14 C48.1 | C50.+ 92,79.93 90.93,78.87 86.49,78.87 84.45,76.83 84.45,75.94
  Top 1.27: U$1.VMOT 5.92,72.98 6.35,72.55 | 20.32,72.55 21.15,73.38 U$5.VMOT | 35.56,72.55 36.39,73.38 U$6.VMOT | U$7.VMOT 51.63,73.38 51.44,73.18 | U$8.VMOT 66.87,72.75 66.67,72.55 | U$9.VMOT 82.11,72.59 81.92,72.39
  Top 1.422: 25.47,72.48 27.94,72.55 | C15.+ 11.74,72.24 11.43,72.55 | 6.99,71.91 6.35,72.55
  Top 1.778: 12.78,72.47 12.7,72.55
  Top 2.54: 6.35,72.55 11.43,72.55 12.7,72.55 20.32,72.55 27.94,72.55 35.56,72.55 | X9.1 6.99,71.91
  Bottom 0.254: v86.68,9.37 88.74,9.37 89.61,10.24 89.61,13.23 95.49,19.1 95.49,41.91 89.22,48.18 89.22,70.48 | v85.09,73.34 85.41,73.66 87.63,73.66 89.22,72.07 89.22,70.48 | v72.01,62.99 72.01,67.31 75.18,70.48 89.22,70.48
  Bottom 0.305: v28.26,44.34 28.26,41.24 JP13.1
  pour Top (isolate 0.254, no thermals): 4.45,73.82 4.45,67.47 13.46,67.47 13.46,70.96 85.72,70.96 85.72,73.82
  pour Top (isolate 0.254, rank 2, no thermals): 24.77,71.12 24.77,67.94 23.81,67.94 23.81,66.99 26.67,66.99 26.67,71.28 24.77,71.28
AGND  (via drill 0.5, 0.6)
  Top 0.254: IC1.11 61.72,30.75 61.72,31.38 62.42,32.08 63.22,32.08 IC1.15 66.77,28.53 C6.2 66.88,27.74 v67.31,27.3 | C44.2 65.94,19.27 v65.72,19.05 | C45.2 v68.58,20.32 | C46.2 v70.48,20.32 | C47.2 v72.39,20.32
  Bottom 0.254: 64.14,11.87 59.69,11.87 59.05,12.51 JP17.1 | 64.14,11.87 JP17.3 | 64.14,11.87 69.22,11.87 | 69.22,11.87 JP17.5 65.41,17.91 65.41,19.05 | 69.22,11.87 73.66,11.87 74.3,12.51 JP17.7 | 65.41,19.05 v65.72,19.05 68.58,19.05 | v68.58,20.32 68.58,19.05 | v70.48,20.32 70.48,19.05 | 70.48,19.05 68.58,19.05 | v72.39,20.32 72.39,19.05 70.48,19.05 | 65.41,19.05 65.41,20.32 67.55,22.46 67.55,27.07 v67.31,27.3
AVCC
  Top 0.254: 64.36,28.82 65.67,27.51 C6.1 65.67,26.97 L1.1 67.34,25.25 63.68,21.59 59.05,21.59 58.59,21.12 RN2.5 RN2.6 RN2.7 RN2.8 | 64.36,28.82 IC1.12 | 64.36,28.82 64.02,28.48 63.28,28.48 IC1.10
BUZZER-RRD  (via drill 0.4, 0.5)
  Top 0.254: v73.03,43.97 72.55,43.5 72.55,40.28 v72.83,40.01 | v63.34,34.77 64.07,34.77 IC1.20
  Bottom 0.254: EXP1.1 66.83,67.47 66.83,66.2 64.77,64.14 64.61,63.98 60.8,60.17 60.8,50.96 65.41,46.35 70.64,46.35 v73.03,43.97 | v63.34,34.77 63.82,34.29 70.17,34.29 72.71,36.83 72.71,39.89 v72.83,40.01
DIR1  (via drill 0.4, 0.5)
  Top 0.254: U$1.DIR 18.46,92.92 17.14,91.6 17.14,89.53 v12.06,84.45 | IC1.80 49.67,33.24 48.5,32.07 46.32,32.07 41.12,37.27 41.12,46.58 42.29,47.75 42.29,50.7 40.46,52.53 v40.46,52.86
  Bottom 0.254: v40.46,52.86 39.37,53.95 39.37,69.88 38.13,71.12 18.57,71.12 12.7,76.99 12.7,83.82 v12.06,84.45
DIR2  (via drill 0.4, 0.5)
  Top 0.254: v57.63,53.66 57.63,49.16 60.26,46.53 60.26,45.92 IC1.49 | v54.61,54.29 54.45,54.13 48.25,54.13 45.24,57.14 45.24,64.45 v46.51,65.72 | U$5.DIR 33.7,92.92 32.38,91.6 32.38,89.53 27.3,84.45 v27.3,84.14
  Bottom 0.254: v27.3,84.14 27.78,83.66 27.78,74.61 29.84,72.55 39.37,72.55 41.12,70.8 41.12,69.22 41.59,68.74 41.59,66.99 42.86,65.72 v46.51,65.72 | v54.61,54.29 55.24,53.66 v57.63,53.66
DIR3  (via drill 0.4, 0.5)
  Top 0.254: U$6.DIR 48.94,92.92 47.62,91.6 47.62,89.69 42.55,84.61 v42.55,84.3 | v43.81,67.39 43.5,67.07 43.5,65.48 43.34,65.33 43.34,56.41 44.29,55.45 44.29,53.13 IC1.58
  Bottom 0.254: v42.55,84.3 43.02,83.82 43.02,68.18 v43.81,67.39
DIR4  (via drill 0.4, 0.5)
  Top 0.254: U$7.DIR 64.18,92.92 62.87,91.6 62.87,89.53 57.78,84.45 v57.78,84.3 | IC1.56 45.56,53.28 45.56,55.51 44.29,56.77 44.29,64.9 44.45,65.06 44.45,66.41 45.24,67.2 v45.24,67.55
  Bottom 0.254: v45.24,67.55 45.16,67.63 45.16,70.38 48.6,73.82 53.98,73.82 57.78,77.63 v57.78,84.3
DIR5  (via drill 0.4, 0.5)
  Top 0.254: U$8.DIR 79.42,92.92 78.11,91.6 78.11,89.69 73.03,84.61 v73.03,84.3 | v59.05,46.35 59.69,46.35 59.77,46.28 59.77,46.14 IC1.50 | v46.35,64.14 46.35,62.23 v51.44,57.15
  Bottom 0.254: v59.05,46.35 53.47,46.35 52.07,47.75 52.07,56.52 v51.44,57.15 | v46.35,64.14 46.35,64.2 47.31,65.15 47.31,69.31 50.43,72.43 54.6,72.43 55.35,73.18 70.48,73.18 73.03,75.72 v73.03,84.3
E1-CONTROL
  Top 0.406: R37.2 12.22,13.06 U$13.4
  Top 1.27: 13.81,10.83 U$13.4
  pour Top (no thermals): 8.89,17.3 8.89,9.05 12.7,9.05 12.7,2.7 15.24,2.7 15.24,17.3
E2-CONTROL
  Top 0.406: R42.2 19.21,13.06 U$14.4
  pour Top (no thermals): 15.75,17.3 15.75,9.05 19.68,9.05 19.68,2.7 22.23,2.7 22.23,17.3
E3-CONTROL
  Top 0.406: R45.2 26.19,13.06 U$15.4
  pour Top (no thermals): 22.73,17.3 22.73,9.05 26.67,9.05 26.67,2.7 29.21,2.7 29.21,17.3
E4-CONTROL
  Top 0.406: R48.2 33.18,13.06 U$16.4
  pour Top (no thermals): 29.72,17.3 29.72,9.05 33.66,9.05 33.66,2.7 36.2,2.7 36.2,17.3
EN1  (via drill 0.4)
  Top 0.254: R20.1 16.84,75.14 U$1.EN | IC1.81 50.03,32.88 48.74,31.59 46.04,31.59 40.64,36.99 40.64,46.86 41.78,48.01 41.78,50.55 39.62,52.7 39.62,54.23 40.32,54.93 v40.56,54.93
  Bottom 0.254: U$1.EN 18.62,74.09 20.64,72.07 38.58,72.07 40.56,70.09 v40.56,54.93
EN2  (via drill 0.4, 0.5)
  Top 0.254: R26.1 32.08,75.14 U$5.EN | v58.42,52.86 58.26,52.7 58.26,49.19 60.96,46.49 60.96,45.92 IC1.48 | v53.82,53.34 53.66,53.5 48.23,53.5 44.77,56.96 44.77,64.64 45.72,65.59 v45.72,66.67
  Bottom 0.254: U$5.EN 33.85,74.25 34.61,73.5 39.94,73.5 42.39,71.06 42.39,70.01 42.56,69.84 42.56,69.23 42.31,68.98 42.31,67.55 43.18,66.67 v45.72,66.67 | v53.82,53.34 54.29,52.86 v58.42,52.86
EN3  (via drill 0.4)
  Top 0.254: v43.74,68.5 43.47,68.5 43.02,68.06 43.02,65.72 42.86,65.56 42.86,56.22 43.74,55.35 43.74,52.98 IC1.59 | R34.1 48.98,75.25 U$6.EN
  Bottom 0.254: v43.74,68.5 43.74,69.14 44.61,70.01 44.61,70.65 U$6.EN
EN4  (via drill 0.4)
  Top 0.254: 64.29,75.09 U$7.EN 64.22,75.25 R39.1 | IC1.57 45.09,53.05 45.09,55.32 43.81,56.59 43.81,65.09 43.97,65.25 43.97,66.6 44.53,67.15 44.53,68.02 45.48,68.98 v46.28,68.98
  Bottom 0.254: U$7.EN 56.64,75.14 54.4,72.89 50.23,72.89 46.31,68.98 v46.28,68.98
EN5  (via drill 0.5)
  Top 0.254: R50.1 79.46,75.25 U$8.EN | v46.99,60.33 51.12,56.2 51.12,55.72 v51.2,55.64 | 50.8,30.8 51.46,31.46 IC1.85 52.06,32.07 54.61,32.07 55.4,32.86 55.4,36.59 v55.17,36.83
  Bottom 0.254: v46.99,60.33 49.65,62.98 49.65,70.01 51.12,71.48 54.96,71.48 55.72,72.23 72.07,72.23 74.98,75.14 U$8.EN | v51.2,55.64 51.2,47.86 56.28,42.78 59.29,42.78 63.26,38.81 63.26,37.23 62.87,36.83 v55.17,36.83
ENET_CRS  (via drill 0.4)
  Top 0.203: IC1.92 51.77,26.83 51.5,26.83 47.45,22.78 47.45,21 47.42,21 46.74,20.32 43.43,20.32 v42.42,21.34
  Bottom 0.203: JP20.7 34.04,33.02 34.92,32.13 34.92,28.83 v42.42,21.34
ENET_MDC  (via drill 0.4)
  Top 0.254: v50.16,28.97 50.38,28.97 IC1.87
  Bottom 0.203: v50.16,28.97 50.31,28.97 50.93,29.59 50.93,30.35 45.97,35.31 32,35.31 31.11,34.42 JP20.5
ENET_MDIO  (via drill 0.4)
  Top 0.203: v37.97,28.57 33.02,28.57 JP20.6
  Top 0.254: IC1.86 51.81,31.1 50.72,30 v50.24,30
  Bottom 0.203: v50.24,30 50.07,30 48.64,28.57 v37.97,28.57
ENET_REF_CLK
  Top 0.203: R53.2 49.22,27.11 IC1.88
ENET_RXD0  (via drill 0.4)
  Top 0.203: IC1.91 51.59,27.35 51.34,27.35 46.97,22.99 46.97,21.24 46.5,20.77 44,20.77 v42.42,22.35
  Bottom 0.203: JP20.10 36.2,28.57 v42.42,22.35
ENET_RXD1  (via drill 0.4)
  Top 0.203: IC1.90 51.4,27.88 51.18,27.88 46.45,23.15 46.45,21.61 46.04,21.19 44.47,21.19 v43.43,22.23
  Bottom 0.203: v43.43,22.23 37.34,28.32 37.34,31.88 JP20.9
ENET_TX_EN  (via drill 0.4)
  Top 0.203: IC1.93 52.08,26.43 51.91,26.43 47.9,22.42 47.9,20.72 46.99,19.81 42.93,19.81 v41.02,21.72 | JP20.12 38.86,30.48 39.24,30.1 v39.24,23.37
  Bottom 0.203: v39.24,23.37 39.37,23.37 v41.02,21.72
ENET_TXD0
  Top 0.203: IC1.95 52.6,25.54 52.21,25.54 48.9,22.23 48.9,19.68 47.62,18.41 40.64,18.41 38.61,20.45 38.61,28.83 37.47,29.97 37.47,32.51 37.97,33.02 JP20.11
  Top 0.254: IC1.95
ENET_TXD1
  Top 0.203: IC1.94 52.31,25.96 52.05,25.96 48.42,22.33 48.42,20.23 47.47,19.27 41.56,19.27 39.97,20.86 39.97,29.18 JP20.14
ESPRX  (via drill 0.5)
  Top 0.254: U$2.7 93.06,46.01 v92.08,46.99
  Bottom 0.254: v92.08,46.99 92.08,46.12 96.14,42.05 96.14,19.07 90.25,13.18 90.25,8.97 89.51,8.23 57.17,8.23 55.24,10.16 55.24,13.34 | 53.78,19.76 53.78,19.64 55.24,18.18 55.24,13.34 | PAD4.1 55.24,13.34
  Bottom 0.305: SJ5.2 52.97,18.95 53.78,19.76 SJ7.2
ESPTX  (via drill 0.48, 0.5)
  Top 0.254: U$2.8 95.06,46.55 v94.61,46.99 | v48.97,16.43 50.72,16.43 v51.36,15.8 | v54.45,15.24 PAD3.1
  Bottom 0.254: v94.61,46.99 94.61,44.96 97.28,42.29 97.28,18.89 91.6,13.21 91.6,8.33 90.25,6.99 48.9,6.99 46.67,9.21 46.67,14.92 47.47,15.72 49.05,15.72 49.69,16.35 | 49.69,16.35 49.69,17.88 | 49.69,16.35 49.05,16.35 v48.97,16.43 | v51.36,15.8 53.9,15.8 v54.45,15.24
  Bottom 0.305: SJ6.2 50.59,19.68 49.78,18.86 49.78,17.98 SJ4.2 49.69,17.88
GND  (via drill 0.4, 0.5, 0.5 pad 0.25, 0.6, 3.2 pad 5.71)
  Top 0.203: C10.1 69.16,40.53 v69.69,40.01 | 52.34,23.87 52.34,23.67 C11.1
  Top 0.254: IC1.41 65.14,45.15 65.27,45.28 C9.1 65.27,47.23 v65.92,47.88 | 73.02,29.92 C3.2 | 46.34,40.03 C14.1 47.5,40.03 IC1.72 50.04,37.49 50.98,37.49 | 52.34,23.87 IC1.97 56.52,28.04 56.52,28.57 v53.98,31.11 | C67.1 83.72,21.07 | 86.85,18.99 U3.6 | v85.72,38.59 85.7,38.59 | IC1.31 67.6,40.53 C10.1 68.24,40.53 68.32,40.64 68.32,46.12 70.36,48.16 v70.36,50.8 | R30.1 15.03,47.57 14.61,47.15 | 38.29,63.81 v37.87,63.39 | 33.34,45.56 33.18,45.72 | C64.2 95.5,69.57 SW3.2 97.43,71.51 LED5.C | 42.94,26.29 42.94,24.79 C51.2 | 42.94,26.29 42.94,28.84 v44.7,30.61 | v53.3,49.39 53.01,49.69 S2.4 53.01,48.26 C8.1 53.02,47.88 52.7,47.55 52.7,46.95 53.41,46.24 53.41,46.14 IC1.55 55.35,44.19 56.12,43.42 56.12,42.62 v55.09,41.59 | 53.01,55.68 53.01,55.64 v53.78,54.87 | T1.E 26.36,35.49 R55.1 | C32.2 25.14,76.57 v26.04,77.47 | C34.- 24.6,81.12 U$5.GND@0 | C31.- 9.37,81.12 U$1.GND@0 | C29.2 9.9,76.57 v10.16,76.83 | 50.98,37.49 v51.2,37.7 | v58.58,53.98 59.62,52.93 C7.2 61.3,51.73 v61.59,51.44 | v46.67,30.8 47.15,30.32 C12.1 48.46,30.32 49.22,31.08 49.66,31.08 IC1.83 51.44,32.86 52.55,32.86 52.7,32.7 53.98,32.7 v54.13,32.86 54.45,33.18 54.45,37.47 | 54.45,37.47 54.45,38.26 v57.63,41.43 | 50.98,37.49 54.43,37.49 54.45,37.47 | v74.77,44.77 75.56,45.55 R31.2 75.74,44.91 76.07,44.58 80.57,44.58 U$2.1 81.06,46.77 v81.28,46.99 | LED9.C 70.93,60.19 v71.91,59.21 | 55.37,56.77 55.37,63.94 56.52,65.09 56.52,67.63 EXP1.9 | C37.- 39.84,81.12 U$6.GND@0 | C35.2 40.38,76.89 v40.64,77.15 | C40.- 55.08,81.12 U$7.GND@0 | C38.2 55.62,77.21 v55.88,77.47 | C43.- 70.32,81.12 U$8.GND@0 | C41.2 70.86,77.21 v71.12,77.47 | C50.- 85.56,81.12 U$9.GND@0
  Top 0.254: C48.2 86.1,77.29 v86.2,77.39 | R55.1 26.02,35.4 v25.58,35.84 | IC7.3 42.88,26.36 42.94,26.29 | v40.39,4.95 40.33,5.01 40.33,7.65 C22.1 | C21.1 48.46,5.28 v48.26,5.08 | C20.1 56.21,5.41 v55.88,5.08 | C19.1 63.83,5.41 v63.5,5.08 | C18.1 71.45,5.41 v71.12,5.08 | C17.1 79.07,5.75 v79.24,5.58 | JP20.4 JP20.3 26.45,35.14 R55.1
  Top 0.305: 99.7,11.99 98.45,11.99 | U3.CDNC1 95.65,14.61 U3.GND1 | U3.CDNC2 95.65,28.51 U3.GND2 | 83.72,21.07 85.8,18.99 86.85,18.99
  Top 0.406: 70.61,51.76 LED1.C | v84,23.49 83.83,23.32 C1.1 83.1,22.99 C67.1 83.13,21.09 | 98.45,11.99 96.21,11.99 SW1.2 94.81,10.59 93.61,10.59 S1.3 | C3.2 73.64,29.96 74.27,30.59 v74.27,31.49 | v23.61,65.29 IC2.3 | v98,3 98,2.89 99.7,4.59 99.7,11.99 | v89.33,17.59 89.33,17.75 88.1,18.99 86.9,18.99 U3.6 | v85.1,32.84 84.27,32.84 C5.1 | U$13.3 9.63,22.75 | R41.1 16.61,22.91 U$14.3 | v87.64,12.49 87.64,11.75 S1.4 | S2.3 53.01,55.68 v54.1,56.77 55.37,56.77 | C30.2 6.44,93.43 U$1.GND | C33.2 21.67,93.43 U$5.GND | C36.2 36.91,93.43 U$6.GND | C39.2 52.15,93.43 U$7.GND | C42.2 67.39,93.43 U$8.GND | C49.2 82.65,93.45 U$9.GND
  Top 0.61: S1.3 S1.4 | 84.22,32.89 C5.1 | 85.7,38.59 84.33,38.59 C4.1 | 70.43,60.19 LED4.C LED3.C LED2.C LED1.C 70.43,50.86 v70.36,50.8 | 70.43,60.19 LED9.C | 70.43,60.19 70.43,62.22 LED12.A
  Top 0.813: 72.86,26.16 72.86,21.76 76.83,17.78 C23.- 76.83,18.41 v78.36,19.94 | C65.2 v33.57,45.92 | 72.86,26.16 72.82,26.12 C13.1 C2.2 | 71.3,26.13 71.3,26.11 71.37,26.04 | C3.2 73.11,26.42 72.86,26.16
  Top 1.016: IC2.5 29.91,61.88 IC2.6 37.67,65.29 v37.87,65.49 37.44,65.75 | v27.37,68.92 30.77,68.92 37.44,65.75 | v37.87,69.79 37.77,69.79 | v36.67,68.69 36.87,68.69 v37.87,67.69 37.77,67.69 | v36.67,66.59 36.67,66.52 37.44,65.75 | v36.67,64.39 36.87,64.39 | v37.87,63.39 v36.67,62.19 36.87,62.19 | D2.2 22.45,69.61 v23.14,68.92 | v33.57,45.92 33.54,45.89 | SW1.2 96.26,11.96
  Top 1.27: 33.54,45.89 33.37,45.72 33.18,45.72 28.03,45.72 U1.1
  Top 1.422: D2.2 18.5,69.61 C15.-
  Top 3.81: 12.7,46.51 13.34,45.88 13.34,43.97
  Bottom 0.203: JP20.4 28.57,18.99 28.83,18.73
  Bottom 0.254: v58.58,53.98 57.47,55.09 53.92,55.09 53.98,55.03 53.94,55.03 v53.78,54.87 52.55,53.64 52.55,50.16 53.3,49.41 v53.3,49.39 | v61.59,51.44 65.15,47.88 v65.92,47.88 68.84,50.8 v70.36,50.8 | ZMX.2 42.86,4.12 | 42.86,4.12 44.45,5.71 48.46,5.71 | v85.72,38.59 85.72,42.55 v81.28,46.99 | 71.54,5.5 71.32,5.71 68.37,5.71 YMN.2 65.72,3.54 63.84,5.42 | 42.86,4.12 41.27,5.71 40.42,5.71 40.33,5.8 | 48.46,5.71 56.26,5.71 | 56.26,5.71 60.58,5.71 | 80.96,4.12 82.55,5.71 90.17,5.71 93.34,2.54 JP4.3 97.03,2.03 v98,3 | JP5.5 40.33,5.8 | v53.98,31.11 53.98,32.7 v54.13,32.86 | v57.63,41.43 55.24,41.43 v55.09,41.59 | v74.77,44.77 74.14,44.77 72.39,46.51 72.39,58.74 v71.91,59.21 71.91,59.85 72.9,60.83 72.9,66.55 75.25,68.9 EXP2.9 | 5.97,77.63 9.37,77.63 v10.16,76.83 | v26.04,77.47 21.36,77.47 U$5.GND@0 | U$6.GND@0 40.12,77.68 v40.64,77.15 | U$7.GND@0 55.67,77.68 v55.88,77.47 | U$8.GND@0 70.91,77.68 v71.12,77.47 | U$9.GND@0 85.92,77.68 v86.2,77.39 | JP14.1 3.28,77.73 3.54,77.47 | JP15.1 98.68,77.73 97.16,76.2 97.16,71.23 SW3.2 | v3,3 2.71,3 0.71,5 0.71,22.78 | v25.58,35.84 25.58,36.06 25.56,36.08 | 40.33,5.8 40.33,5.01 v40.39,4.95 | 48.46,5.71 48.46,5.28 v48.26,5.08 | 56.26,5.71 56.26,5.46 v55.88,5.08 | 63.84,5.42 63.55,5.71 60.58,5.71 | v63.5,5.08 63.84,5.42 | v71.12,5.08 71.54,5.5 | XMN.2 80.96,4.12 | 80.96,4.12 79.51,5.58 v79.24,5.58 79.14,5.68 79.14,5.71 75.99,5.71 XMX.2 73.34,3.7 71.54,5.5 | 60.58,5.71 58.42,3.55 58.42,3.18 57.31,4.29 51.7,4.29 ZMN.2 | v46.67,30.8 44.9,30.8 v44.7,30.61
  Bottom 0.406: v35.07,61.19 35.67,61.19 | v87.64,12.49 87.64,13.95 89.33,15.65 v89.33,17.59 | 86.62,38.59 86.62,33.54 86.08,32.99 85.25,32.99 v85.1,32.84 85.1,24.59 v84,23.49
  Bottom 0.61: X14.GND 89.82,37.53 88.77,38.59 86.62,38.59 v85.72,38.59
  Bottom 0.813: v84,23.49 v83.99,23.5 81.92,23.5 v78.36,19.94 | JP5.5 35.28,14.15 v30.7,18.73 28.83,18.73 v23.72,18.73 v16.73,18.73 v9.75,18.73
  Bottom 1.016: v23.14,68.92 v27.37,68.92
  Bottom 1.27: U$1.GND 3.54,92.92 3.54,77.68 | 3.54,77.68 U$1.GND@0 5.97,77.63 | 3.54,77.68 3.54,77.47 3.54,63.77 5.59,61.72 X9.2 12.94,67.68 18.15,67.68 19.39,68.92 v23.14,68.92 | 32.56,53.52 32.37,53.72 27.05,53.72 17.14,43.81 | v33.57,45.92 33.57,50.72 | v35.07,61.19 35.07,56.02 32.56,53.52 | v14.61,41.43 14.61,43.18 15.24,43.81 17.14,43.81 | 17.14,43.81 22.23,43.81 25.56,40.48 25.56,36.08 | 32.56,53.52 32.56,51.73 33.57,50.72 | 33.66,50.8 33.57,50.72
  other vias: 98,98 37.87,61.19 35.27,69.79 35.27,67.59 35.17,65.49 35.17,63.29 8.26,21.27 10.86,21.27 10.86,18.73 8.26,20 15.49,21.27 17.84,21.27 17.84,18.73 15.49,20 22.48,21.27 24.83,21.27 24.83,18.73 22.48,20 29.46,21.27 31.69,21.27 31.69,18.73 29.46,18.73 6.99,49.05 8.26,49.05 9.53,49.05 10.79,49.05 10.79,41.43 12.06,41.43 13.34,41.43 6.99,43.97 8.26,43.97 9.53,43.97 10.79,43.97 9.53,47.78 12.06,49.05 12.06,46.51 12.06,45.24 9.53,46.51 9.53,45.24 12.06,47.78 10.79,42.7 3,98 17.84,20 15.49,18.73 8.26,18.73 10.86,20 22.48,18.73 24.83,20 29.46,20 31.69,20 96.84,93.03 98.11,93.03 99.38,93.03 96.84,91.76 98.11,91.76 99.38,91.76 0.95,93.03 2.22,93.03 3.49,93.03 0.95,91.76 2.22,91.76 3.49,91.76 96.84,90.49 98.11,90.49 99.38,90.49 96.84,89.22 98.11,89.22 99.38,89.22 96.84,87.95 98.11,87.95 99.38,87.95 96.84,86.68 98.11,86.68 99.38,86.68 96.84,85.41 98.11,85.41 99.38,85.41 96.84,84.14 98.11,84.14 99.38,84.14 96.84,82.87 98.11,82.87 99.38,82.87 96.84,81.6 98.11,81.6 99.38,81.6 0.95,90.49 2.22,90.49 3.49,90.49 0.95,89.22 2.22,89.22 3.49,89.22 0.95,87.95 2.22,87.95 3.49,87.95 0.95,86.68 2.22,86.68 3.49,86.68 0.95,85.41 2.22,85.41 3.49,85.41 0.95,84.14 2.22,84.14 3.49,84.14 0.95,82.87 2.22,82.87 3.49,82.87 0.95,81.6 2.22,81.6 3.49,81.6 0.95,69.53 0.95,68.26 0.95,66.99 0.95,65.72 0.95,64.45 0.95,63.18 0.95,61.91 0.95,60.64 0.95,59.37 0.95,70.8 0.95,72.07 35.81,50.67 83.43,52.46 82.42,52.46 81.4,52.46 91.31,52.46 74.92,58.42 91.31,51.44 91.31,50.42 91.31,49.41 98.67,42.93 99.94,42.93 10.79,47.78 10.79,46.51 10.79,45.24 12.06,43.97 12.06,42.7 13.34,47.78 14.61,47.78 14.61,46.51 14.61,45.24 14.61,43.97 14.61,42.7 15.88,46.51 15.88,45.24 15.88,43.97 15.88,42.7
  pour Bottom (isolate 0.254, rank 5, no thermals): 0,-1.11 101.6,-1.11 101.6,101.44 0,101.44
  pour Top (no thermals): 7.62,21.75 10.95,21.75 10.95,17.94 7.62,17.94
  pour Top (no thermals): 15.24,21.75 18.57,21.75 18.57,17.94 15.24,17.94
  pour Top (no thermals): 22.23,21.75 24.92,21.75 24.92,17.94 22.23,17.94
  pour Top (no thermals): 28.57,21.75 31.91,21.75 31.91,17.94 28.57,17.94
  pour Top (isolate 0.254, no thermals): 5.08,49.69 5.08,42.7 10.16,42.7 10.16,40.8 15.24,40.8 15.24,49.69
  pour Bottom (rank 3, no thermals): 5.08,48.42 5.08,43.34 10.16,43.34 10.16,48.42
  pour Top (isolate 0.254, rank 5, no thermals): 0,0 101.6,0 101.6,100.97 0,100.97
HEATBED-CONTROL  (via drill 0.5)
  Top 0.254: R32.2 20.54,28.52 U$10.2 | 2,28 v1.91,28.1 | 5.2,27.58 v5.71,28.1
  Top 0.61: D15.A 5.2,27.58
  other vias: 6.99,28.1 3.17,28.1 4.45,28.1 8.26,28.1 9.53,28.1 10.79,28.1 12.06,28.1 5.71,34.45 6.99,34.45 3.17,34.45 4.45,34.45 1.91,34.45 8.26,34.45 5.71,33.18 6.99,33.18 3.17,33.18 4.45,33.18 1.91,33.18 8.26,33.18 1.91,31.91 3.17,31.91 4.45,31.91 1.91,30.64 3.17,30.64 4.45,30.64 5.71,29.37 6.99,29.37 3.17,29.37 4.45,29.37 1.91,29.37 8.26,29.37 9.53,29.37 9.53,30.64 13.34,28.1
  pour Top (isolate 0.254, no thermals): 0.64,26.83 13.97,26.83 13.97,28.42 22.86,28.42 22.86,42.07 16.51,42.07 16.51,39.53 10.16,39.53 10.16,35.08 0.64,35.08
  pour Bottom (isolate 0.406, no thermals): 0.64,27.3 13.97,27.3 13.97,28.73 19.68,28.73 19.68,42.07 16.51,42.07 16.51,39.53 10.16,39.53 10.16,35.08 0.64,35.08
HEATBEDVIN
  Top 0.254: 4.45,36.35 0.79,36.35 0.79,25.88 1.4,25.27 6.71,25.27 D15.C 7.5,26.42 7.91,26.83 14.49,26.83 LED6.A
  pour Top (isolate 0.406, rank 2, no thermals): 9.53,57.31 0,57.31 0,35.72 9.53,35.72 9.53,43.34 5.71,43.34 5.71,49.69 9.53,49.69
  pour Bottom (isolate 0.406, rank 2, no thermals): 9.53,57.31 0,57.31 0,35.72 9.53,35.72 9.53,42.7 5.08,42.7 5.08,50.32 9.53,50.32
HEATERVIN  (via drill 0.5)
  Top 0.254: 6.99,16.03 6.99,23.34 7.46,23.81 12.06,23.81 | 12.06,24.13 11.95,24.25 LED7.A 11.91,23.97 12.06,23.81 | 12.06,23.81 19.68,23.81 | LED8.A 19.57,24.25 19.68,24.13 19.68,23.81 | 19.68,23.81 26.04,23.81 | 26.04,23.81 32.43,23.81 LED11.A | LED10.A 25.88,23.97 26.04,23.81
  Top 0.406: 6.99,16.03 X1.1
  Top 1.27: D5.C 17.65,6.85 | D6.C 25.01,6.85 | D13.C 31.62,6.85
  Top 1.778: JP21.1 18.24,7.44 | JP22.1 25.22,7.44 | JP23.1 32.21,7.44
  Top 1.93: 18.24,7.44 17.65,6.85 | JP16.1 11.25,7.44 10.66,6.85 D4.C | 25.01,6.85 25.02,6.86 24.64,6.86 25.22,7.44 | 32.21,7.44 31.62,6.85
  other vias: 6.59,1.35 7.86,1.35 7.86,2.62 7.86,3.89 7.86,5.16 7.86,7.38 6.59,7.38 7.22,6.43 6.59,5.16 5.32,7.38 4.05,7.38 2.78,7.38 2.14,6.43 5.95,6.43 6.59,3.89 6.59,2.62 4.68,6.43 3.41,6.43
  pour Top (isolate 0.254, rank 2, no thermals): 0,17.3 0,-0.48 36.2,-0.48 36.2,8.54 8.26,8.54 8.26,17.3
  pour Bottom (isolate 0.254, no thermals): 0,8.26 34.92,8.26 34.92,0 0,0
ISP_BOOT  (via drill 0.5)
  Top 0.254: IC1.53 55.12,45.84 55.12,46.18 56.42,47.48 56.42,47.87 R15.1 55.97,48.53 56.42,48.98 56.42,50.37 S2.2 56.81,51.93 v56.67,52.07 | U$2.15 83.19,61.13 83.19,60.33 81.28,58.42 78.11,58.42 72.64,63.88 63.12,63.88 61.9,62.66 61.9,56.81 60.96,55.88 56.85,55.88 S2.1 56.81,55.54 55.24,53.98 55.24,52.7 v54.29,51.75
  Bottom 0.254: v54.29,51.75 56.36,51.75 v56.67,52.07
LED1  (via drill 0.4, 0.5)
  Top 0.254: R10.2 68.58,48.97 68.58,47.5 67.86,46.78 67.86,41.51 IC1.32 64.77,38.42 64.45,38.42 63.96,37.93 62.53,37.93 v62.39,37.78 | R55.2 27.46,36.09 27.46,39.69 28.16,40.38 R54.1 28.79,41.12 v35.4,41.12
  Bottom 0.254: v35.4,41.12 36.48,41.12 37.27,40.32 55.88,40.32 58.9,37.31 61.91,37.31 v62.39,37.78
LED2  (via drill 0.5)
  Top 0.254: IC1.33 67.39,41.75 67.39,47.02 67.94,47.57 67.94,48.9 66.2,50.64 64.93,50.64 64.61,50.96 64.61,53.66 | 64.61,53.66 64.93,53.98 65.53,53.98 R11.2 | 64.61,53.66 v64.61,54.45 | v88.27,84.45 88.27,84.61 93.34,89.69 93.34,91.6 94.66,92.92 U$9.DIR
  Bottom 0.254: v88.27,84.45 88.27,78.11 86.36,76.2 85.04,76.2 82.5,73.66 75.06,73.66 63.12,61.72 63.12,55.94 v64.61,54.45
LED3  (via drill 0.5)
  Top 0.254: 64.89,39.97 IC1.34 66.91,41.97 66.91,47.2 67.31,47.6 67.31,48.82 66.04,50.09 64.72,50.09 63.9,50.91 63.9,55.48 64.53,56.12 64.61,56.12 | 64.61,56.12 65.57,56.12 R12.2 | 64.61,56.12 v64.61,56.52 | U$9.STEP 94.81,89.73 v89.53,84.45
  Bottom 0.254: v89.53,84.45 89.53,78.11 87.05,75.62 85.11,75.62 82.53,73.03 75.18,73.03 63.75,61.59 63.75,57.37 v64.61,56.52
LED4  (via drill 0.5)
  Top 0.254: 64.54,40.33 IC1.35 66.44,42.2 66.44,47.39 66.67,47.62 66.67,48.66 65.8,49.53 64.53,49.53 63.26,50.8 63.26,57.47 63.9,58.1 64.61,58.1 | R52.1 94.7,75.25 U$9.EN | 64.61,58.1 65.54,58.1 R13.2 | 64.61,58.1 v64.61,58.5
  Bottom 0.254: U$9.EN 85.3,75.14 82.55,72.39 75.44,72.39 65.66,62.61 65.28,62.23 64.61,61.56 v64.61,58.5
MOSI1  (via drill 0.5)
  Top 0.254: v50.09,45.56 50.45,45.56 IC1.60
  Bottom 0.254: EXP1.3 61.59,67.63 61.59,66.04 59.69,64.14 55.96,64.14 50.09,58.26 v50.09,45.56
N$1
  Top 0.254: IC1.22 67.72,32.53 67.72,30.78 68.5,30.01 Q2.2 69.34,29.63 | 69.34,28.4 69.37,28.4 C2.1
  Top 0.305: 69.34,29.63 69.34,28.4
N$2
  Top 0.254: IC1.23 68.18,32.78 70.02,32.78 71.17,31.64 Q2.1 71.22,31.66 C3.1
N$3
  Top 0.254: LED5.A 95.73,73.18 95.25,73.66 90.94,73.66 R18.1
N$4
  Top 0.254: D11.C 50.62,5.49 ZMN.3
N$5
  Top 0.254: D10.C 58.24,5.49 YMX.3
N$6
  Bottom 0.254: SJ8.2 18.57,77.63 U$1.MS1
  Bottom 0.406: SJ8.2 15.11,77.63 15.11,77.6
N$7
  Top 0.254: D9.C 65.86,5.49 YMN.3
N$8
  Bottom 0.254: SJ9.2 16.68,80.22 U$1.MS2
  Bottom 0.406: SJ9.2 15.11,80.17 15.11,80.14
N$9
  Top 1.016: 21.66,65.72 D2.1
  Top 1.422: 21.66,65.72 19.86,65.72 17.45,63.32 L2.1
  pour Top (isolate 0.254, no thermals): 20.32,60.96 20.32,66.04 26.04,66.04 26.04,67.94 17.78,67.94 17.78,66.04 14.61,66.04 14.61,60.96
N$10
  Bottom 0.254: SJ10.2 16.68,82.76 U$1.MS3
  Bottom 0.406: SJ10.2 15.11,82.71 15.11,82.68
N$11
  Top 0.254: D8.C 73.48,5.49 XMX.3
N$12
  Top 0.254: U$5.RST U$5.SLP
N$13
  Top 0.254: D7.C 81.1,5.49 XMN.3
N$14  (via drill 0.5)
  Top 0.254: R25.2 28.47,77.21 v29.21,77.95
  Bottom 0.254: SJ13.1 SJ12.1 SJ11.1 30.19,78.11 29.37,78.11 v29.21,77.95
N$15
  Bottom 0.254: SJ11.2 33.81,77.63 U$5.MS1
  Bottom 0.406: SJ11.2 30.35,77.63 30.35,77.47
N$16
  Top 0.254: D12.C 43,5.49 ZMX.3
N$17
  Bottom 0.254: SJ12.2 33.81,80.17 U$5.MS2
  Bottom 0.406: SJ12.2 30.23,80.17 30.23,80.14
N$18
  Top 0.254: U$2.11 91.12,61.2 91.12,60.33 89.85,59.05 85.09,59.05 81.92,55.88 79.38,55.88 78.09,54.6 R28.2
N$19
  Bottom 0.254: SJ13.2 33.81,82.71 U$5.MS3
  Bottom 0.406: SJ13.2 30.35,82.71 30.35,82.68
N$20
  Top 0.254: R27.2 18.73,44.93 U$10.1
N$21
  Top 0.508: LED6.C R32.1
N$22
  Top 0.254: U$6.RST U$6.SLP
N$23
  Top 0.61: R57.1 LED12.C
N$24  (via drill 0.5)